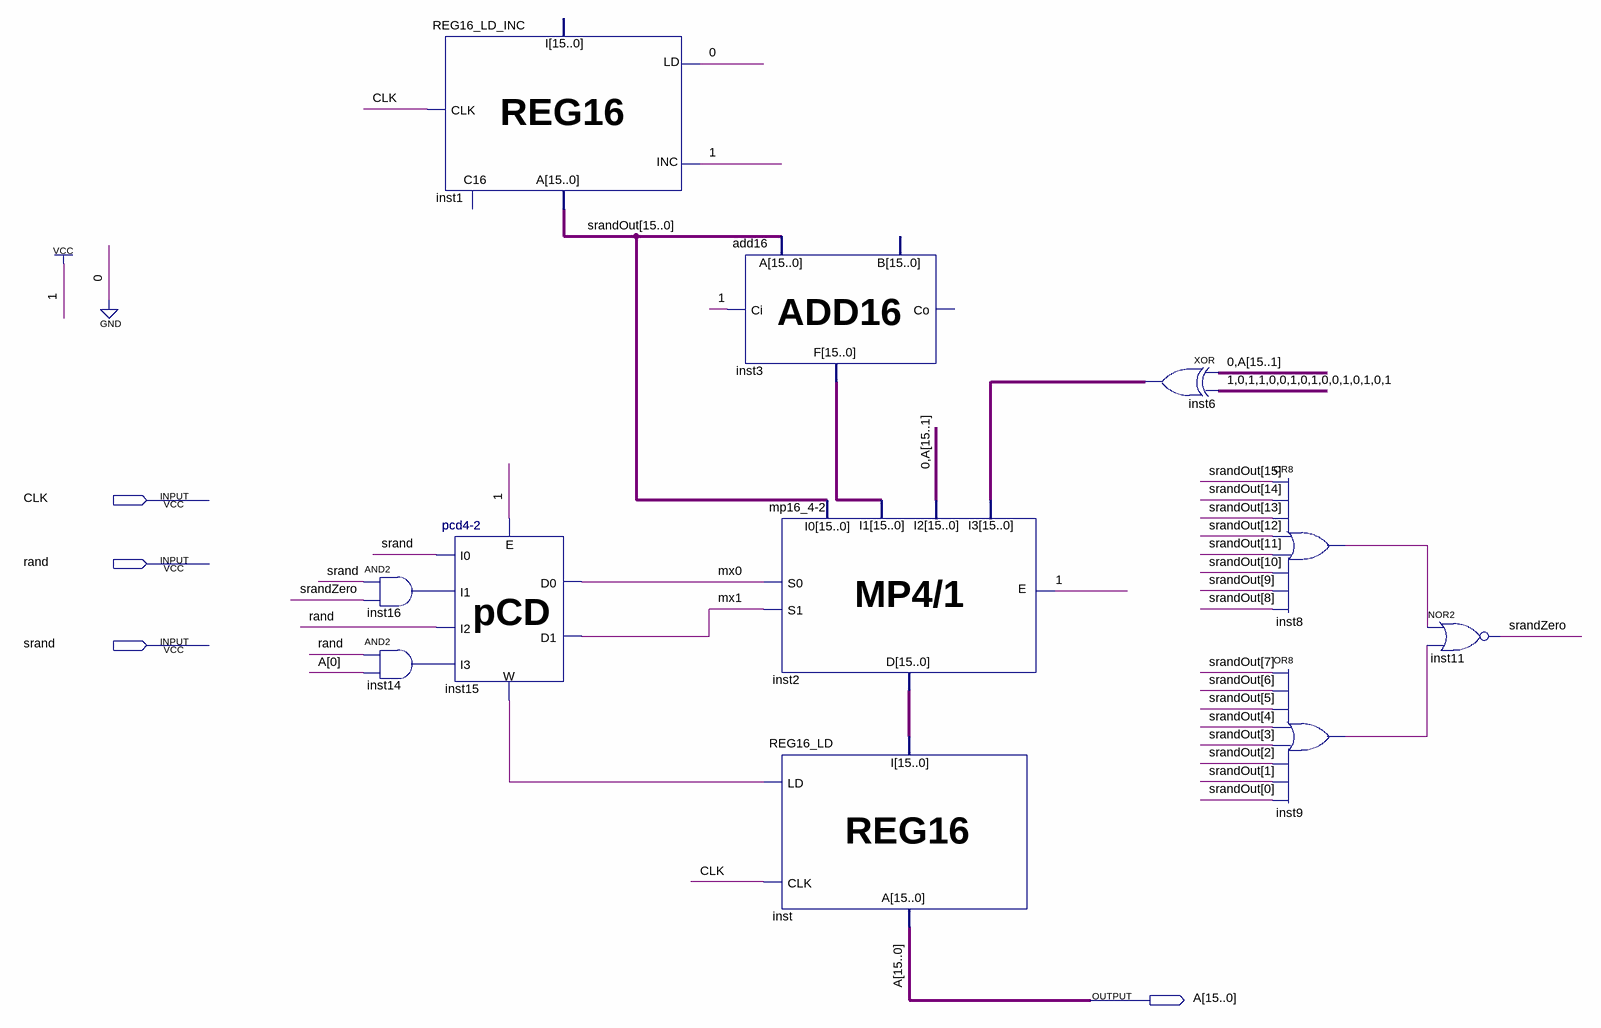
[diagram p0: schematic sheet]
// Quartus schematic lfsr.bdf as structural Verilog: 11 symbols, 4 pins
module lfsr (
  input  CLK,
  input  \rand ,
  input  srand,
  output [15:0] A
);

  wire inst8_out, inst9_out, inst14_out, inst15_w, inst16_out, mx0, mx1, srandZero;
  wire [15:0] inst2_d, inst3_f, inst6_out, srandOut;

  and inst16 (inst16_out, srand, srandZero);
  and inst14 (inst14_out, \rand , A[0]);
  REG16_LD_INC inst1 (.CLK(CLK), .LD(1'b0), .INC(1'b1), .A(srandOut));  // open: I, C16
  \pcd4-2  inst15 (
    .E(1'b1), .I0(srand), .I1(inst16_out), .I2(\rand ), .I3(inst14_out), .D1(mx1), .D0(mx0), .W(inst15_w));
  add16 inst3 (.A(srandOut), .Ci(1'b1), .F(inst3_f));  // open: B, Co
  \mp16_4-2  inst2 (
    .E(1'b1), .I0(srandOut), .I1(inst3_f), .I2({1'b0, A[15:1]}), .I3(inst6_out), .S0(mx0), .S1(mx1),
    .D(inst2_d));
  REG16_LD inst (.I(inst2_d), .CLK(CLK), .LD(inst15_w), .A(A));
  assign inst6_out = {1'b0, A[15:1]} ^ 16'b1011001010010101;  // XOR inst6, 16 bits wide
  or inst8 (inst8_out, srandOut[15], srandOut[14], srandOut[13], srandOut[12], srandOut[11], srandOut[10], srandOut[9], srandOut[8]);
  or inst9 (inst9_out, srandOut[7], srandOut[6], srandOut[5], srandOut[4], srandOut[3], srandOut[2], srandOut[1], srandOut[0]);
  nor inst11 (srandZero, inst8_out, inst9_out);
endmodule
